# Altium schematic sheet PIC Microcontroller Design.SchDoc
size B; SheetNumber: 6; SheetTotal: 10
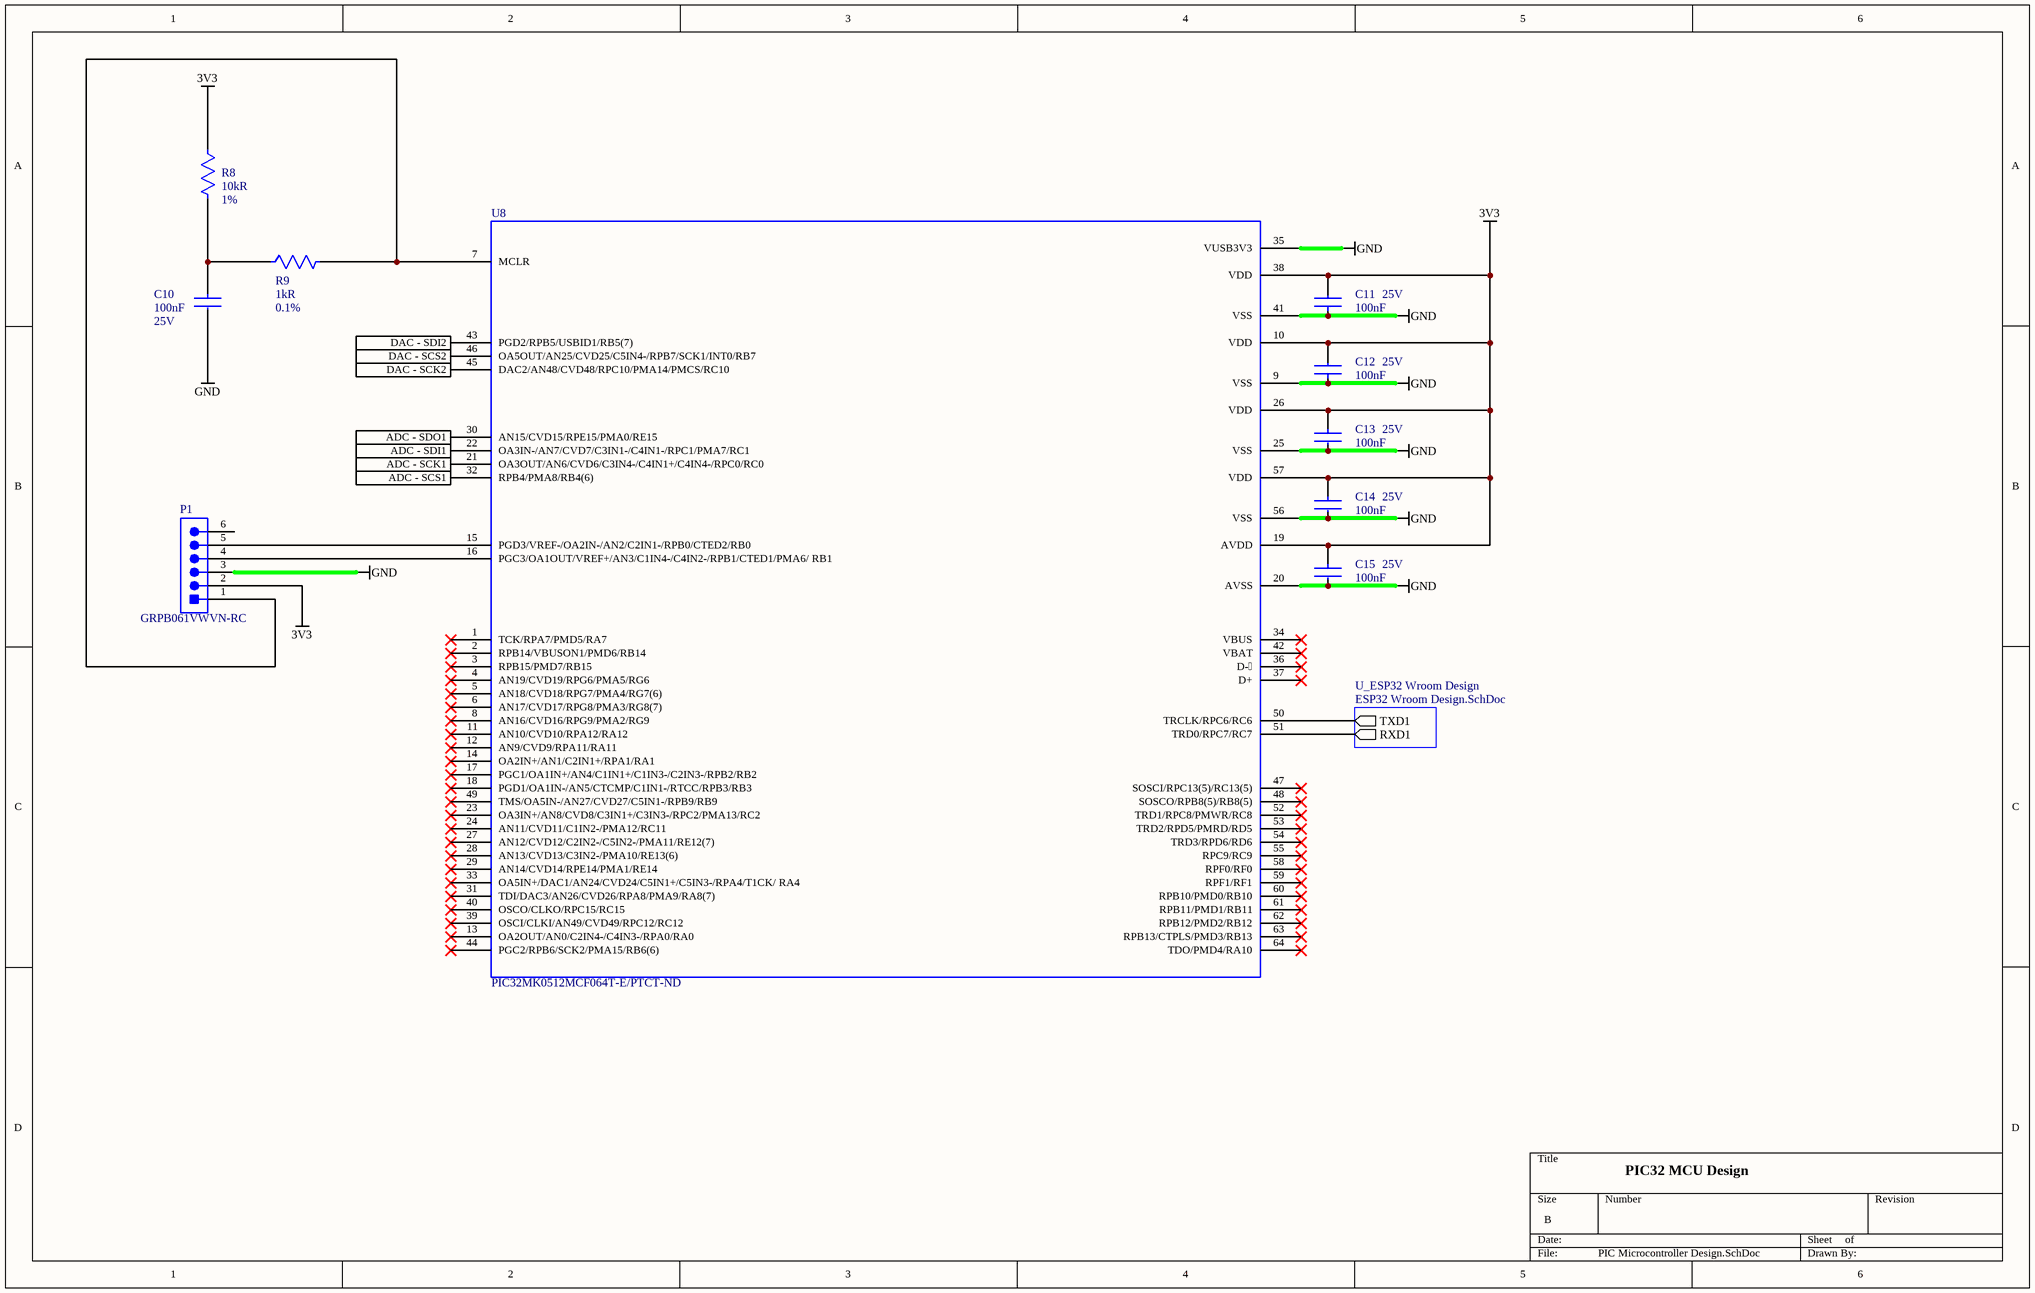
[diagram p0: PIC Microcontroller Design.SchDoc]

## Parts
C10  Voltage: 25V  Capacitance: 100nF  [FP-CL278-IPC_C]  (hidden comment: 0.1uF)
C11  Voltage: 25V  Capacitance: 100nF  [FP-CL278-IPC_C]  (hidden comment: 0.1uF)
C12  Voltage: 25V  Capacitance: 100nF  [FP-CL278-IPC_C]  (hidden comment: 0.1uF)
C13  Voltage: 25V  Capacitance: 100nF  [FP-CL278-IPC_C]  (hidden comment: 0.1uF)
C14  Voltage: 25V  Capacitance: 100nF  [FP-CL278-IPC_C]  (hidden comment: 0.1uF)
C15  Voltage: 25V  Capacitance: 100nF  [FP-CL278-IPC_C]  (hidden comment: 0.1uF)
P1  GRPB061VWVN-RC  [SLIN-GRPB061VWVN-RC_V]
R8  Resistance: 10kR  Tolerance: 1%  [FP-RMCF0201-IPC_B]  (hidden comment: RMCF0201FT10K0)
R9  Tolerance: 0.1%  Resistance: 1kR  [FP-RG2012-IPC_B]  (hidden comment: 1k ohm)
U8  PIC32MK0512MCF064T-E/PTCT-ND  [PIC32]

## Sub-sheets
U_ESP32 Wroom Design = ESP32 Wroom Design.SchDoc: TXD1 (out), RXD1 (out)

## Ports
ADC - SCK1 (out), ADC - SCS1 (out), ADC - SDI1 (in), ADC - SDO1 (out), DAC - SCK2 (out), DAC - SCS2 (out), DAC - SDI2 (out)

## Nets
3V3: C11.2 C12.2 C13.1 C14.1 C15.1 P1.2 R8.1 U8.10(VDD) U8.19(AVDD) U8.26(VDD) U8.38(VDD) U8.57(VDD)
GND: C10.2 C11.1 C12.1 C13.2 C14.2 C15.2 P1.3 U8.9(VSS) U8.20(AVSS) U8.25(VSS) U8.35(VUSB3V3) U8.41(VSS) U8.56(VSS)
ADC - SCK1: U8.21(OA3OUT/AN6/CVD6/C3IN4-/C4IN1+/C4IN4-/RPC0/RC0) ; port ADC - SCK1
ADC - SCS1: U8.32(RPB4/PMA8/RB4(6)) ; port ADC - SCS1
ADC - SDI1: U8.22(OA3IN-/AN7/CVD7/C3IN1-/C4IN1-/RPC1/PMA7/RC1) ; port ADC - SDI1
ADC - SDO1: U8.30(AN15/CVD15/RPE15/PMA0/RE15) ; port ADC - SDO1
DAC - SCK2: U8.45(DAC2/AN48/CVD48/RPC10/PMA14/PMCS/RC10) ; port DAC - SCK2
DAC - SCS2: U8.46(OA5OUT/AN25/CVD25/C5IN4-/RPB7/SCK1/INT0/RB7) ; port DAC - SCS2
DAC - SDI2: U8.43(PGD2/RPB5/USBID1/RB5(7)) ; port DAC - SDI2
NetC10_1: C10.1 R8.2 R9.1
NetP1_1: P1.1 R9.2 U8.7(MCLR)
NetP1_4: P1.4 U8.16(PGC3/OA1OUT/VREF+/AN3/C1IN4-/C4IN2-/RPB1/CTED1/PMA6/_RB1)
NetP1_5: P1.5 U8.15(PGD3/VREF-/OA2IN-/AN2/C2IN1-/RPB0/CTED2/RB0)
NetU8_50: U8.50(TRCLK/RPC6/RC6) ; sheet U_ESP32 Wroom Design/TXD1
NetU8_51: U8.51(TRD0/RPC7/RC7) ; sheet U_ESP32 Wroom Design/RXD1

Not connected (* = marked no-connect by the designer): P1 6; U8 1(TCK/RPA7/PMD5/RA7)* 2(RPB14/VBUSON1/PMD6/RB14)* 3(RPB15/PMD7/RB15)* 4(AN19/CVD19/RPG6/PMA5/RG6)* 5(AN18/CVD18/RPG7/PMA4/RG7(6))* 6(AN17/CVD17/RPG8/PMA3/RG8(7))* 8(AN16/CVD16/RPG9/PMA2/RG9)* 11(AN10/CVD10/RPA12/RA12)* 12(AN9/CVD9/RPA11/RA11)* 13(OA2OUT/AN0/C2IN4-/C4IN3-/RPA0/RA0)* 14(OA2IN+/AN1/C2IN1+/RPA1/RA1)* 17(PGC1/OA1IN+/AN4/C1IN1+/C1IN3-/C2IN3-/RPB2/RB2)* 18(PGD1/OA1IN-/AN5/CTCMP/C1IN1-/RTCC/RPB3/RB3)* 23(OA3IN+/AN8/CVD8/C3IN1+/C3IN3-/RPC2/PMA13/RC2)* 24(AN11/CVD11/C1IN2-/PMA12/RC11)* 27(AN12/CVD12/C2IN2-/C5IN2-/PMA11/RE12(7))* 28(AN13/CVD13/C3IN2-/PMA10/RE13(6))* 29(AN14/CVD14/RPE14/PMA1/RE14)* 31(TDI/DAC3/AN26/CVD26/RPA8/PMA9/RA8(7))* 33(OA5IN+/DAC1/AN24/CVD24/C5IN1+/C5IN3-/RPA4/T1CK/_RA4)* 34(VBUS)* 36(D-)* 37(D+)* 39(OSCI/CLKI/AN49/CVD49/RPC12/RC12)* 40(OSCO/CLKO/RPC15/RC15)* 42(VBAT)* 44(PGC2/RPB6/SCK2/PMA15/RB6(6))* 47(SOSCI/RPC13(5)/RC13(5))* 48(SOSCO/RPB8(5)/RB8(5))* 49(TMS/OA5IN-/AN27/CVD27/C5IN1-/RPB9/RB9)* 52(TRD1/RPC8/PMWR/RC8)* 53(TRD2/RPD5/PMRD/RD5)* 54(TRD3/RPD6/RD6)* 55(RPC9/RC9)* 58(RPF0/RF0)* 59(RPF1/RF1)* 60(RPB10/PMD0/RB10)* 61(RPB11/PMD1/RB11)* 62(RPB12/PMD2/RB12)* 63(RPB13/CTPLS/PMD3/RB13)* 64(TDO/PMD4/RA10)*

## Notes on the sheet
- PIC32 MCU Design

## Library data of the parts
C10-C15 = CMP-13271-000728-1: Cap Ceramic 100nF 25V X5R ±10% SMD 0402 +85°C Paper T/R; Package Quantity: 1; Height: 0.5mm; Case Code (Metric): 1005; Thickness: 0.022inch; Mount: Surface Mount; Lead Free: Lead Free; Case Code (Imperial): 0402; Packaging: Tape and Reel; Depth: 0.5mm; Min Operating Temperature: -55°C; Voltage Rating: 25V; Dielectric: X5R; Case/Package: 0402; Tolerance: 10%; Width: 0.02inch; Max Operating Temperature: 85°C; Length: 1mm; Radiation Hardening: No; Voltage Rating (DC): 25V
P1 = CMP-2000-06374-1: Male Header, Pitch 1.27 mm, 1 x 6 Position, Height 4 mm, Tail Length 2.3 mm, -40 to 105 degC, RoHS, Bulk; Manufacturer: Sullins; Other Names: S9014E-06; Number of Positions Loaded: All; Pitch: 0.050"(1.27mm); Connector Type: Header,Unshrouded; Mating Products: S9010E-06-ND / -CONNHEADER.050"6POSR/APCB / S9008E-06-ND / -CONNHEADER.050"6POSPCBGOLD / S9005E-06-ND / -CONNHEADER.050"6POSSMDGOLD; Dynamic Catalog: GRPB; Number of Positions: 6; Catalog Drawings: S9014ESeriesTop; Family: RectangularConnectors-Headers,MalePins; Contact Mating Length: 0.118"(3.00mm); Termination: Solder; Contact Finish: Gold; Manufacturer URL: http://www.sullinscorp.com/; Category: Connectors,Interconnects; Package Description: Male Header, Pitch 1.27 mm, 1 x 6 Position, Height 4 mm, Tail Length 2.3 mm; Standard Package: 1; Packaging: Bulk; Datasheet Version: Rev. C, 12/2008; Contact Type: MalePin; Number of Rows: 1; Package Reference: GRPB061VWVN-RC; Mounting Technology: ThroughHole; Contact Finish Thickness: Flash; Datasheet URL: http://www.sullinscorp.com/drawings/71_GRPB___1VWVN-RC,_10957-C.pdf; Mounting Type: ThroughHole
R8 = CMP-26527-002755-1: RES 10K OHM 1% 1/20W 0201; Max Power Dissipation: 50mW; Temperature Coefficient: 200ppm/°C; Length: 0.024inch; Min Operating Temperature: -55°C; Width: 0.012inch; Contact Plating: Tin; Case/Package: 0201; Power Rating: 50mW; Packaging: Tape and Reel; Resistor Type: Thick Film; Case Code (Metric): 0603; Case Code (Imperial): 0201; Max Operating Temperature: 125°C; Height: 0.009inch; Mount: Surface Mount; Series: RMCF; RoHS Compliant: Yes; Number of Terminations: 2
R9 = CMP-2001-02697-2: Automotive Metal Thin Film Chip Resistor, 0805, 1kΩ, 0.1%, 25ppm/°C, 0.125W, 150V; Power Rating: 100mW; Voltage Rating: 100V; Max Power Dissipation: 125mW; RoHS Compliant: Yes; Length: 0.079inch; Case Code (Metric): 2012; Width: 0.049inch; Case/Package: 0805; Height: 0.02inch; Max Operating Temperature: 155°C; Package Quantity: 1; Case Code (Imperial): 0805; Number of Terminations: 2; Lead Free: Lead Free; Temperature Coefficient: 25ppm/°C; Working Voltage: 150V; Features: Automotive AEC-Q200; Packaging: Tape and Reel; Resistor Type: Thin Film; Voltage Rating (DC): 150V; Termination: SMD/SMT; Series: RG; Technology: THIN FILM; Min Operating Temperature: -55°C
U8 = PIC32MK